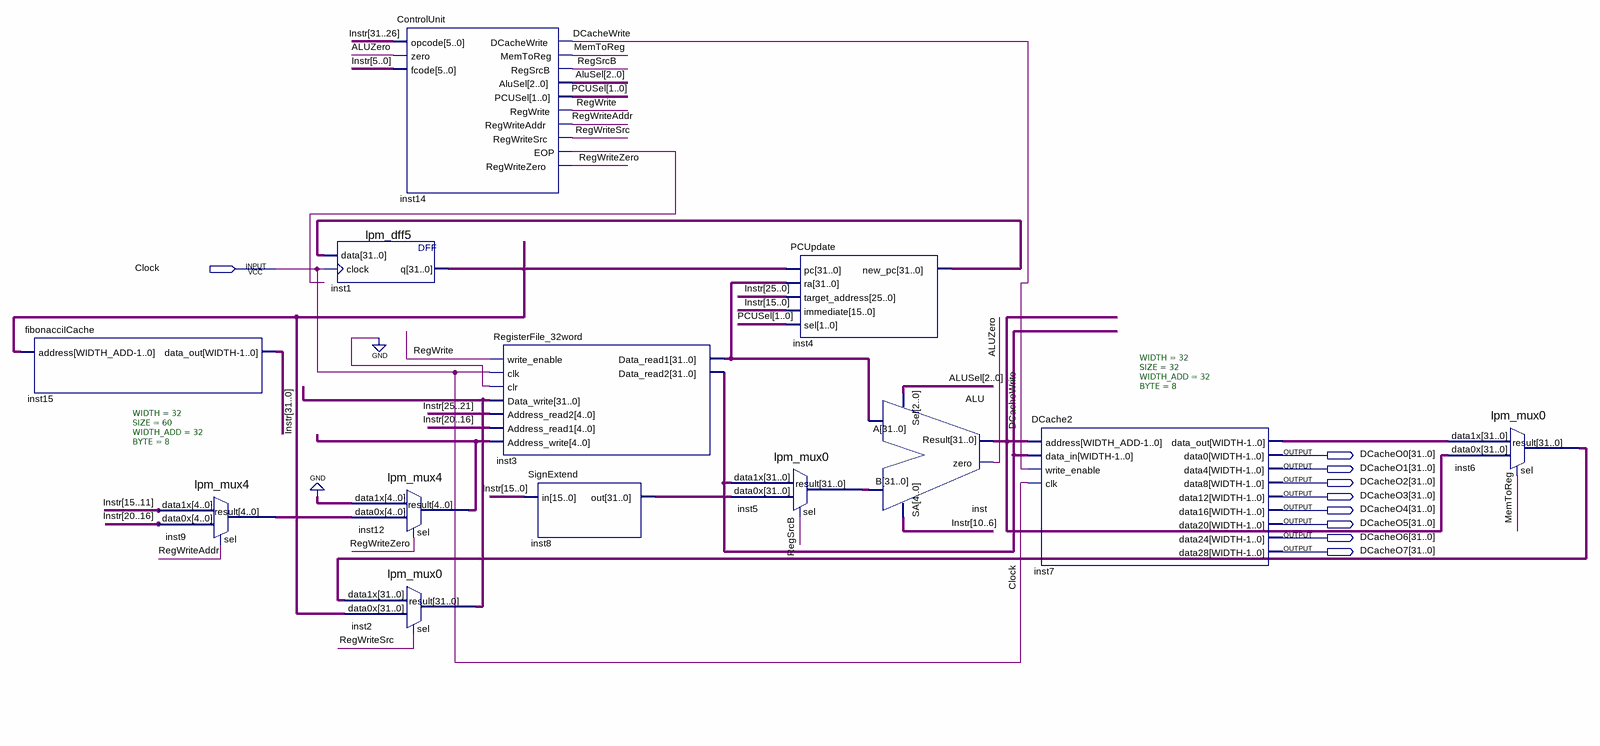
[diagram p0: schematic sheet]
// Quartus schematic Datapath.bdf as structural Verilog: 13 symbols, 9 pins
module Datapath (
  input  Clock,
  output [31:0] DCacheO0,
  output [31:0] DCacheO1,
  output [31:0] DCacheO2,
  output [31:0] DCacheO3,
  output [31:0] DCacheO4,
  output [31:0] DCacheO5,
  output [31:0] DCacheO6,
  output [31:0] DCacheO7
);

  wire ALUZero, DCacheWrite, inst14_eop, MemToReg, RegSrcB, RegWrite, RegWriteAddr, RegWriteSrc, RegWriteZero;
  wire [1:0] PCUSel;
  wire [2:0] ALUSel;
  wire [4:0] inst9_result, inst12_result;
  wire [31:0] inst1_q, inst2_result, inst3_data_read1, inst3_data_read2, inst4_new_pc, inst5_result,
       inst6_result, inst7_data_out, inst8_out, inst_result, Instr;

  fibonacciICache #(.WIDTH(32), .SIZE(60), .WIDTH_ADD(32), .BYTE(8)) inst15 (.address(inst1_q), .data_out(Instr));
  lpm_mux4 inst9 (.data1x(Instr[15:11]), .data0x(Instr[20:16]), .sel(RegWriteAddr), .result(inst9_result));
  lpm_dff5 inst1 (.data(inst4_new_pc), .clock(Clock), .q(inst1_q));
  lpm_mux4 inst12 (.data1x({5{1'b0}}), .data0x(inst9_result), .sel(RegWriteZero), .result(inst12_result));
  lpm_mux0 inst2 (.data1x(inst6_result), .data0x(inst1_q), .sel(RegWriteSrc), .result(inst2_result));
  ControlUnit inst14 (
    .opcode(Instr[31:26]), .zero(ALUZero), .fcode(Instr[5:0]), .DCacheWrite(DCacheWrite),
    .MemToReg(MemToReg), .RegSrcB(RegSrcB), .AluSel(ALUSel), .PCUSel(PCUSel), .RegWrite(RegWrite),
    .RegWriteAddr(RegWriteAddr), .RegWriteSrc(RegWriteSrc), .EOP(inst14_eop), .RegWriteZero(RegWriteZero));
  RegisterFile_32word inst3 (
    .write_enable(RegWrite), .clk(Clock), .clr(1'b0), .Data_write(inst2_result),
    .Address_read2(Instr[25:21]), .Address_read1(Instr[20:16]), .Address_write(inst12_result),
    .Data_read1(inst3_data_read1), .Data_read2(inst3_data_read2));
  SignExtend inst8 (.in(Instr[15:0]), .out(inst8_out));
  lpm_mux0 inst5 (.data1x(inst3_data_read2), .data0x(inst8_out), .sel(RegSrcB), .result(inst5_result));
  PCUpdate inst4 (
    .pc(inst1_q), .ra(inst3_data_read1), .target_address(Instr[25:0]), .immediate(Instr[15:0]), .sel(PCUSel),
    .new_pc(inst4_new_pc));
  ALU inst (
    .Sel(ALUSel), .A(inst3_data_read1), .B(inst5_result), .SA(Instr[10:6]), .Result(inst_result),
    .zero(ALUZero));
  DCache2 #(.WIDTH(32), .SIZE(32), .WIDTH_ADD(32), .BYTE(8)) inst7 (
    .address(inst_result), .data_in(inst3_data_read2), .write_enable(DCacheWrite), .clk(Clock),
    .data_out(inst7_data_out), .data0(DCacheO0), .data4(DCacheO1), .data8(DCacheO2), .data12(DCacheO3),
    .data16(DCacheO4), .data20(DCacheO5), .data24(DCacheO6), .data28(DCacheO7));
  lpm_mux0 inst6 (.data1x(inst7_data_out), .data0x(inst_result), .sel(MemToReg), .result(inst6_result));
endmodule
